# EAGLE design RNS board (EAGLE 9.5.1)
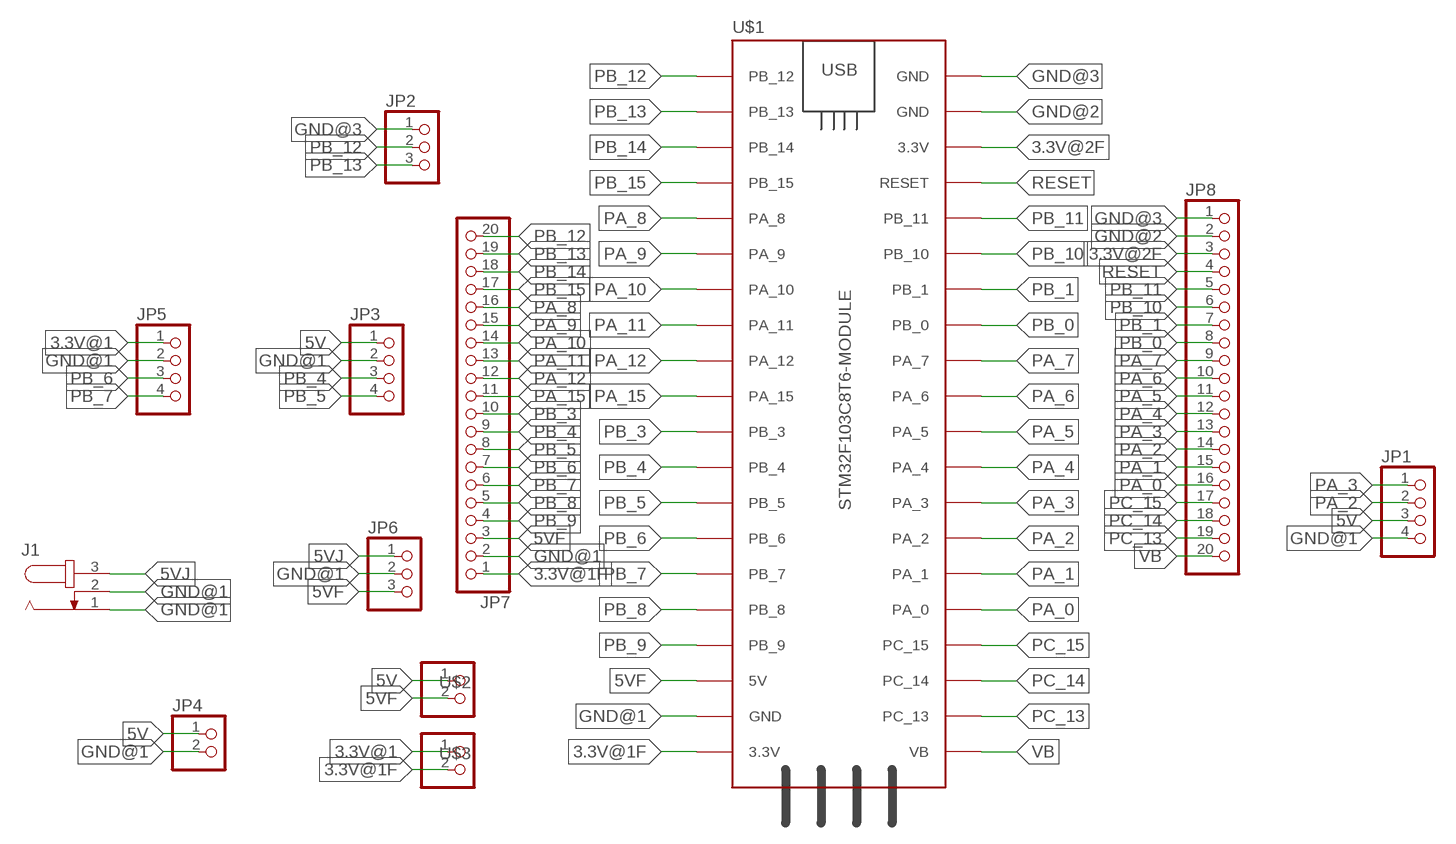
[diagram p0: schematic, sheet 1]

## Parts
J1  JACK-PLUG0  [SPC4077]
JP1  PINHD-1X4  [1X04]
JP2  PINHD-1X3  [1X03]
JP3  PINHD-1X4  [1X04]
JP4  PINHD-1X2  [1X02]
JP5  PINHD-1X4  [1X04]
JP6  PINHD-1X3  [1X03]
JP7  PINHD-1X20  [1X20]
JP8  PINHD-1X20  [1X20]
U$1  STM32F103C8T6-MODULE  [STM32F103C8T6-MODULE]
U$2  PINHD-1X2  [1X02]
U$3  PINHD-1X2  [1X02]

## Nets
3.3V@1: JP5.1 U$3.1
3.3V@1F: JP7.1 U$1.3.3V_1(3.3V) U$3.2
3.3V@2F: JP8.3 U$1.3.3V_2(3.3V)
5V: JP1.3 JP3.1 JP4.1 U$2.1
5VF: JP6.3 JP7.3 U$1.5V U$2.2
5VJ: J1.3 JP6.1
GND@1: J1.1 J1.2 JP1.4 JP3.2 JP4.2 JP5.2 JP6.2 JP7.2 U$1.GND_1(GND)
GND@2: JP8.2 U$1.GND_2(GND)
GND@3: JP2.1 JP8.1 U$1.GND_3(GND)
PA_0: JP8.16 U$1.PA_0
PA_1: JP8.15 U$1.PA_1
PA_2: JP1.2 JP8.14 U$1.PA_2
PA_3: JP1.1 JP8.13 U$1.PA_3
PA_4: JP8.12 U$1.PA_4
PA_5: JP8.11 U$1.PA_5
PA_6: JP8.10 U$1.PA_6
PA_7: JP8.9 U$1.PA_7
PA_8: JP7.16 U$1.PA_8
PA_9: JP7.15 U$1.PA_9
PA_10: JP7.14 U$1.PA_10
PA_11: JP7.13 U$1.PA_11
PA_12: JP7.12 U$1.PA_12
PA_15: JP7.11 U$1.PA_15
PB_0: JP8.8 U$1.PB_0
PB_1: JP8.7 U$1.PB_1
PB_3: JP7.10 U$1.PB_3
PB_4: JP3.3 JP7.9 U$1.PB_4
PB_5: JP3.4 JP7.8 U$1.PB_5
PB_6: JP5.3 JP7.7 U$1.PB_6
PB_7: JP5.4 JP7.6 U$1.PB_7
PB_8: JP7.5 U$1.PB_8
PB_9: JP7.4 U$1.PB_9
PB_10: JP8.6 U$1.PB_10
PB_11: JP8.5 U$1.PB_11
PB_12: JP2.2 JP7.20 U$1.PB_12
PB_13: JP2.3 JP7.19 U$1.PB_13
PB_14: JP7.18 U$1.PB_14
PB_15: JP7.17 U$1.PB_15
PC_13: JP8.19 U$1.PC_13
PC_14: JP8.18 U$1.PC_14
PC_15: JP8.17 U$1.PC_15
RESET: JP8.4 U$1.RESET
VB: JP8.20 U$1.VB

## Library data of the parts
J1 = con-jack:JACK-PLUG: DC POWER JACK Power Jack, DC, Right Angle, Through Hole, Rated 5A at 16VDC, PC Terminals Distributor: Farnell (www.Farnell.de) Drawing: 84N1161.pdf / 84N1162.pdf Manufacturer: SPC Technology (www.spctechnology.com) Type: SPC4077 / SPC 4078; OC_FARNELL: unknown; OC_NEWARK: unknown
JP1 JP3 = MIA_LIBRARY-2-2-2:PINHD-1X4: PIN HEADER
JP2 = MIA-Training:PINHD-1X3: PIN HEADER
JP4 U$2 U$3 = MIA_LIBRARY-2-2-2:PINHD-1X2: PIN HEADER
JP5 = MIA-Training:PINHD-1X4: PIN HEADER
JP6 = MIA_LIBRARY-2-2-2:PINHD-1X3: PIN HEADER
JP7 JP8 = MIA_LIBRARY-2-2-2:PINHD-1X20: PIN HEADER
U$1 = MIA_LIBRARY-2-2-2:STM32F103C8T6-MODULE: STM32F103C8T6 module with ARM Cortex-3, 20kB SRAM, 64kB Flash, 72MHz

## Board
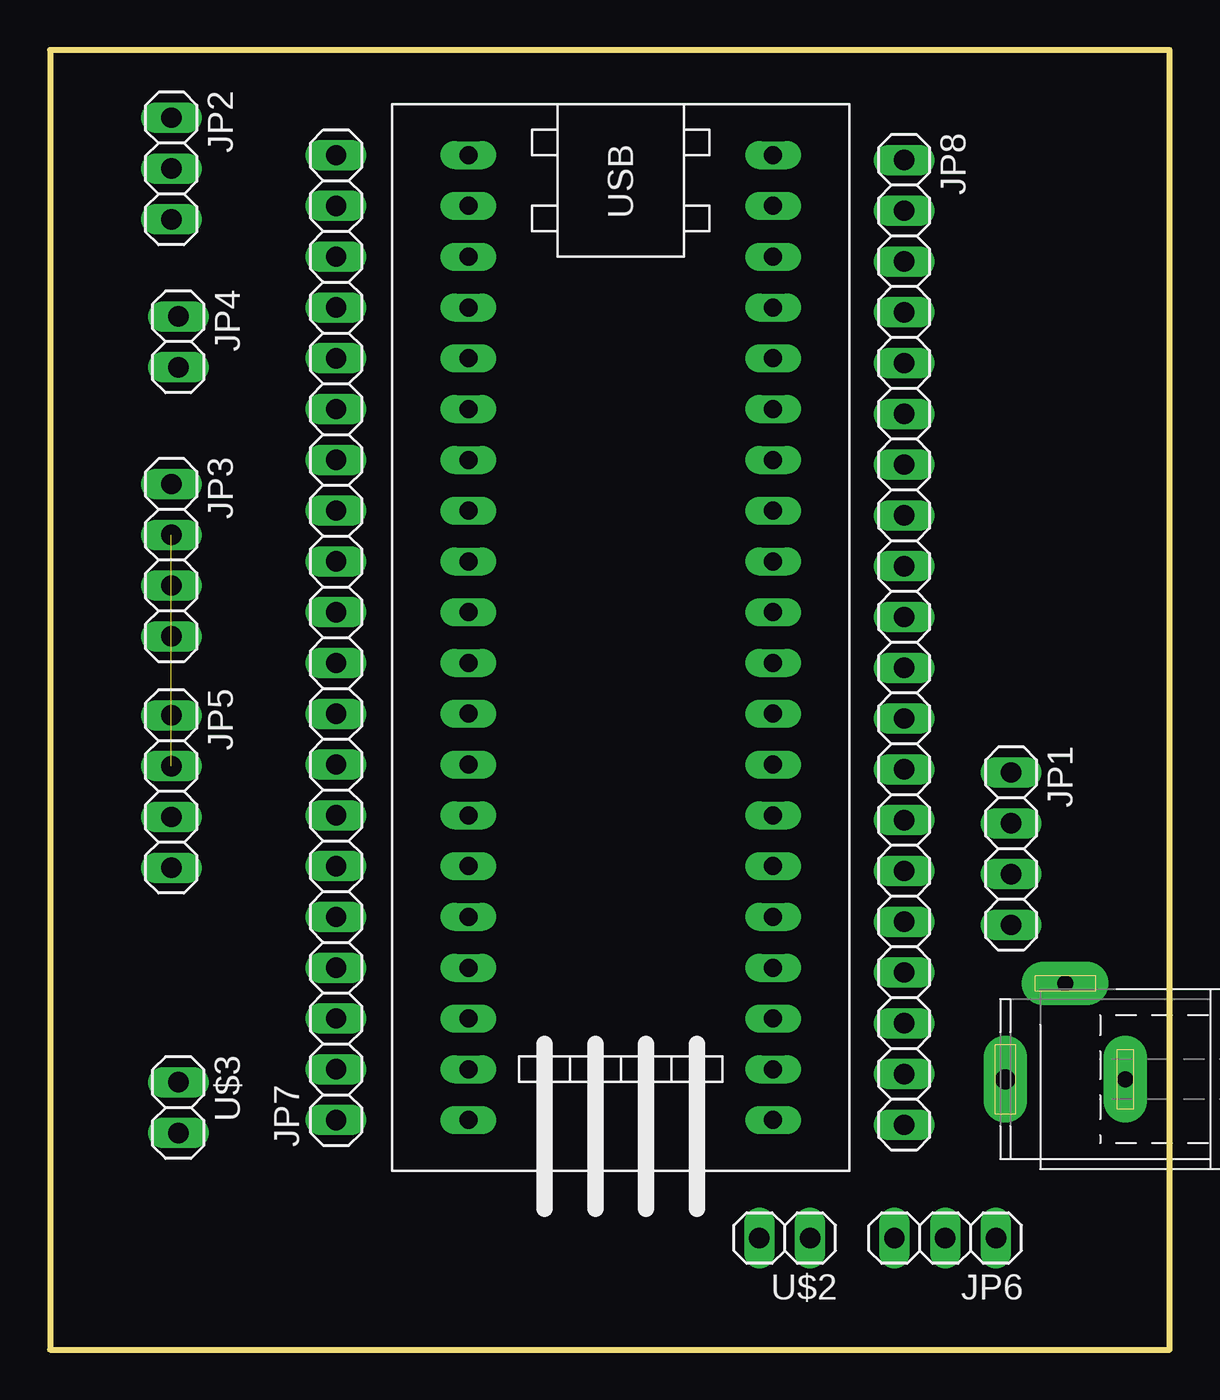
[diagram p1: board, top side]
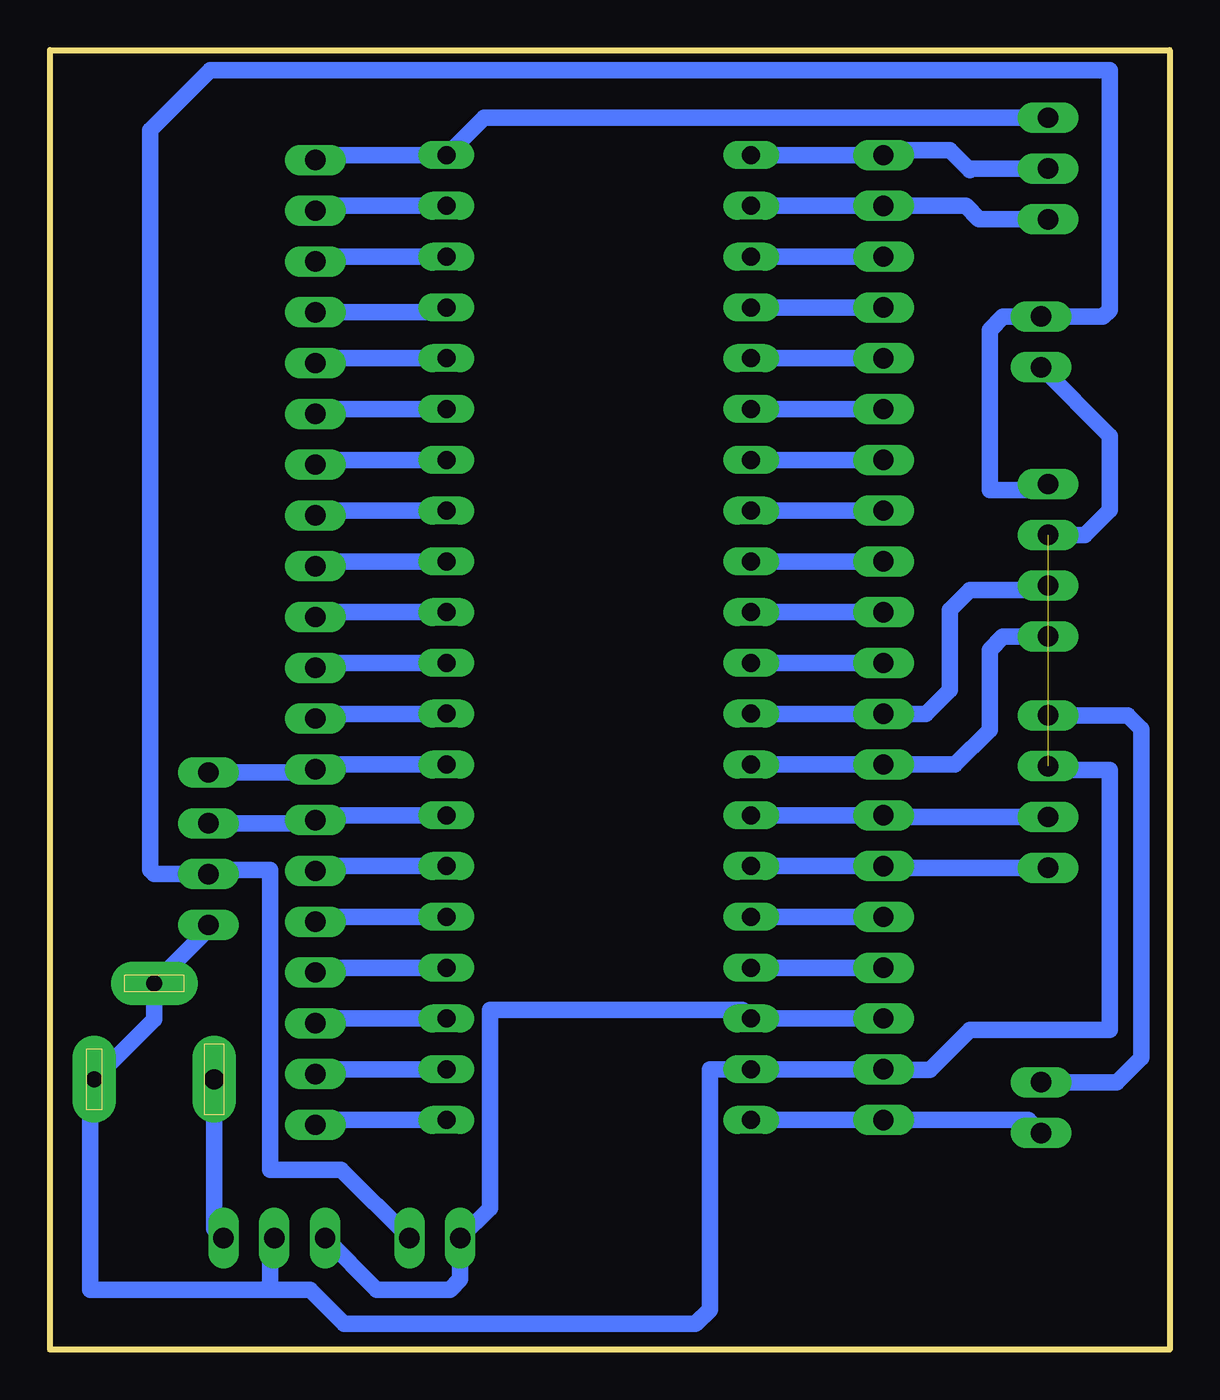
[diagram p2: board, bottom side, seen from below]

Size 56 x 65 mm. Coordinates in mm from the lower left corner, seen from the top.
Outline: 0,0 56,0 56,65 0,65 0,0
Copper layers (1*16): Top 0.035mm / dielectric 1.5mm / Bottom 0.035mm
Design rules "default": minimum track width 6mil, minimum drill 0.35mm, track to track 6mil, track to pad 6mil, pad to pad 6mil, via to via 6mil, smd to smd 6mil, copper to edge 40mil, drill to drill 6mil, minimum pad ring 10mil, minimum via ring 8mil, stop-mask expansion 4mil, vias tented up to drill 0mil, thermal gap 10mil

### Footprints (pad centres in the part's own frame; a part is rotated, then mirrored left to right if it is on the bottom)
SPC4077 = drill 0.8 pad 2.184 long: 1 -3,0; 2 0,-4.8 | drill 1 pad 2.184 long: 3 3,0
1X04 = drill 1.016 long: 1 -3.81,0; 2 -1.27,0; 3 1.27,0; 4 3.81,0
1X03 = drill 1.016 long: 1 -2.54,0; 2 0,0; 3 2.54,0
1X02 = drill 1.016 long: 1 -1.27,0; 2 1.27,0
1X20 = drill 1.016 long: 1 -24.13,0; 2 -21.59,0; 3 -19.05,0; 4 -16.51,0; 5 -13.97,0; 6 -11.43,0; 7 -8.89,0; 8 -6.35,0; 9 -3.81,0; 10 -1.27,0; 11 1.27,0; 12 3.81,0; 13 6.35,0; 14 8.89,0; 15 11.43,0; 16 13.97,0; 17 16.51,0; 18 19.05,0; 19 21.59,0; 20 24.13,0
STM32F103C8T6-MODULE = drill 0.9 long: 3.3V_1 25.4,-7.62; 3.3V_2 -17.78,7.62; 5V 20.32,-7.62; GND_1 22.86,-7.62; GND_2 -20.32,7.62; GND_3 -22.86,7.62; PA_0 15.24,7.62; PA_1 12.7,7.62; PA_2 10.16,7.62; PA_3 7.62,7.62; PA_4 5.08,7.62; PA_5 2.54,7.62; PA_6 0,7.62; PA_7 -2.54,7.62; PA_8 -12.7,-7.62; PA_9 -10.16,-7.62; PA_10 -7.62,-7.62; PA_11 -5.08,-7.62; PA_12 -2.54,-7.62; PA_15 0,-7.62; PB_0 -5.08,7.62; PB_1 -7.62,7.62; PB_3 2.54,-7.62; PB_4 5.08,-7.62; PB_5 7.62,-7.62; PB_6 10.16,-7.62; PB_7 12.7,-7.62; PB_8 15.24,-7.62; PB_9 17.78,-7.62; PB_10 -10.16,7.62; PB_11 -12.7,7.62; PB_12 -22.86,-7.62; PB_13 -20.32,-7.62; PB_14 -17.78,-7.62; PB_15 -15.24,-7.62; PC_13 22.86,7.62; PC_14 20.32,7.62; PC_15 17.78,7.62; RESET -15.24,7.62; VB 25.4,7.62

### Placement (x,y rotation side)
J1  50.78,13.52 180 top
JP1  48.07,25.05 270 top
JP2  6.07,59.07 270 top
JP3  6.07,39.48 270 top
JP4  6.42,50.4 270 top
JP5  6.07,27.91 270 top
JP6  44.78,5.58 180 top
JP7  14.31,35.61 90 top
JP8  42.72,35.37 270 top
U$1  28.55,36.88 270 top
U$2  36.75,5.58 180 top
U$3  6.42,12.1 270 top

### Tracks (layer width: path | path; a pad name or v marks a point on that pad's centre or on a via)
3.3V@1
  Bottom 0.813: JP5.1 2.08,31.72 1.41,31.05 1.41,14.59 2.63,13.37 U$3.1
3.3V@1F
  Bottom 0.813: U$1.3.3V_1 JP7.1 7.07,11.48 U$3.2
3.3V@2F
  Bottom 0.813: U$1.3.3V_2 42.48,54.66 JP8.3
5V
  Bottom 0.813: JP3.1 6.36,43 9,43 9,51 8.33,51.67 JP4.1 3.33,51.67 3,52 3,64 48,64 51,61 51,24 50.78,23.78 JP1.3 47.85,24 45,24 45,9 41.44,9 U$2.1
5VF
  Bottom 0.813: JP7.3 U$1.5V 21.37,17 34,17 34,7.06 U$2.2 35.48,3.52 36,3 39.66,3 JP6.3
5VJ
  Bottom 0.813: JP6.1 47.78,6.04 J1.3
GND@1  (1 unrouted)
  Bottom 0.813: JP1.4 48.07,21.03 J1.2 50.78,16.52 J1.1 54,13.3 54,3 45,3 | JP4.2 2.99,45.7 2.99,42.74 3,42.73 3,42 4.25,40.75 JP3.2 | JP5.2 5.89,29 3,29 3,16 10,16 12,14 14.29,14 JP7.2 U$1.GND_1 22.98,14.02 23,14 23,2 23.72,1.28 41.28,1.28 43,3 45,3 | JP6.2 45,5.36 45,3
GND@2
  Bottom 0.813: U$1.GND_2 42.48,57.2 JP8.2
GND@3
  Bottom 0.813: JP8.1 42.48,59.74 U$1.GND_3 34.3,61.61 JP2.1
PA_0
  Bottom 0.813: U$1.PA_0 42.48,21.64 JP8.16
PA_1
  Bottom 0.813: U$1.PA_1 42.48,24.18 JP8.15
PA_2
  Bottom 0.813: U$1.PA_2 42.48,26.72 JP8.14 42.88,26.32 JP1.2
PA_3
  Bottom 0.813: U$1.PA_3 42.48,29.26 JP8.13 42.88,28.86 JP1.1
PA_4
  Bottom 0.813: U$1.PA_4 42.48,31.8 JP8.12
PA_5
  Bottom 0.813: U$1.PA_5 42.48,34.34 JP8.11
PA_6
  Bottom 0.813: U$1.PA_6 42.48,36.88 JP8.10
PA_7
  Bottom 0.813: U$1.PA_7 42.48,39.42 JP8.9
PA_8
  Bottom 0.813: JP7.16 U$1.PA_8
PA_9
  Bottom 0.813: JP7.15 U$1.PA_9
PA_10
  Bottom 0.813: JP7.14 U$1.PA_10
PA_11
  Bottom 0.813: JP7.13 U$1.PA_11
PA_12
  Bottom 0.813: JP7.12 U$1.PA_12
PA_15
  Bottom 0.813: JP7.11 U$1.PA_15
PB_0
  Bottom 0.813: U$1.PB_0 42.48,41.96 JP8.8
PB_1
  Bottom 0.813: U$1.PB_1 42.48,44.5 JP8.7
PB_3
  Bottom 0.813: JP7.10 U$1.PB_3
PB_4
  Bottom 0.813: U$1.PB_4 JP7.9 12.2,31.8 11,33 11,37 10,38 6.28,38 JP3.3
PB_5
  Bottom 0.813: U$1.PB_5 JP7.8 10.74,29.26 9,31 9,35 8.33,35.67 JP3.4
PB_6
  Bottom 0.813: U$1.PB_6 JP7.7 14.23,26.64 JP5.3
PB_7
  Bottom 0.813: U$1.PB_7 JP7.6 14.23,24.1 JP5.4
PB_8
  Bottom 0.813: JP7.5 U$1.PB_8
PB_9
  Bottom 0.813: JP7.4 U$1.PB_9
PB_10
  Bottom 0.813: U$1.PB_10 42.48,47.04 JP8.6
PB_11
  Bottom 0.813: U$1.PB_11 42.48,49.58 JP8.5
PB_12
  Bottom 0.813: U$1.PB_12 JP7.20 14.05,60 11,60 10,59 9.93,59.07 JP2.2
PB_13
  Bottom 0.813: U$1.PB_13 15,57.2 JP7.19 10.2,57.2 9.53,56.53 JP2.3
PB_14
  Bottom 0.813: JP7.18 U$1.PB_14
PB_15
  Bottom 0.813: JP7.17 U$1.PB_15
PC_13
  Bottom 0.813: U$1.PC_13 42.48,14.02 JP8.19
PC_14
  Bottom 0.813: U$1.PC_14 42.48,16.56 JP8.18
PC_15
  Bottom 0.813: U$1.PC_15 42.48,19.1 JP8.17
RESET
  Bottom 0.813: U$1.RESET 36.41,51.88 JP8.4
VB
  Bottom 0.813: U$1.VB 42.48,11.48 JP8.20